# Altium schematic sheet analog_current_output.schdoc
size A3; Organization: Altium Limited; Address1: L3, 12a Rodborough Rd; Address2: Frenchs Forest; Address3: NSW; Address4: Australia 2086
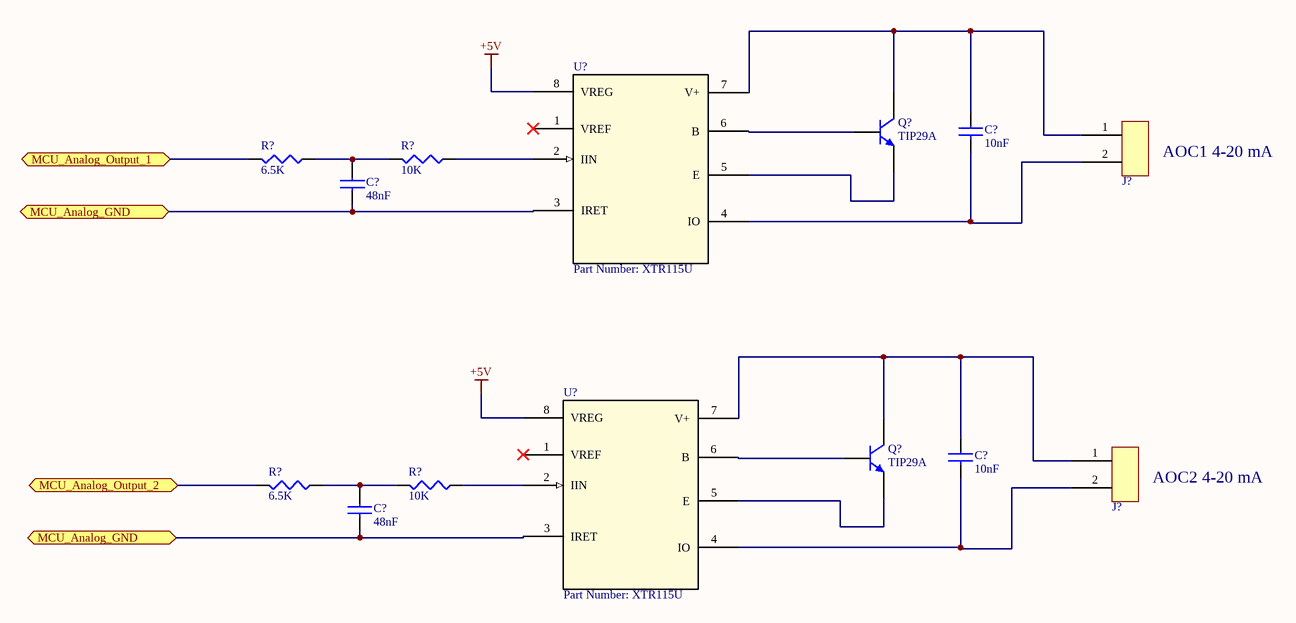
[diagram p0: analog_current_output.schdoc]

## Parts
(Parts that share a designator on the sheet are numbered #1, #2 ... from top to bottom, then left to right.)
C?#1  value 10nF  [0402 SMD Ceramic Capacitor]  (hidden comment: 0402_10nF)
C?#2  value 48nF  [0805 SMD Ceramic Capacitor]  (hidden comment: C0805C333)
C?#3  value 10nF  [0402 SMD Ceramic Capacitor]  (hidden comment: 0402_10nF)
C?#4  value 48nF  [0805 SMD Ceramic Capacitor]  (hidden comment: C0805C333)
J?#1  2x Terminal  [2x Terminal mini]  (value not drawn)
J?#2  2x Terminal  [2x Terminal mini]  (value not drawn)
Q?#1  TIP29A  [TO220 SMD]
Q?#2  TIP29A  [TO220 SMD]
R?#1  value 6.5K  [0805 Resistor]  (hidden comment: 0805_1K)
R?#2  value 10K  [0805 Resistor]  (hidden comment: 0805_1K)
R?#3  value 6.5K  [0805 Resistor]  (hidden comment: 0805_1K)
R?#4  value 10K  [0805 Resistor]  (hidden comment: 0805_1K)
U?#1  Part Number: XTR115U  [D8]
U?#2  Part Number: XTR115U  [D8]

## Ports
MCU_Analog_GND (bidir), MCU_Analog_Output_1 (bidir), MCU_Analog_Output_2 (bidir)

## Nets
+5V: U?#1.8(VREG) U?#2.8(VREG)
MCU_Analog_GND: C?#2.2 C?#4.2 U?#1.3(IRET) U?#2.3(IRET) ; port MCU_Analog_GND
MCU_Analog_Output_1: R?#1.2 ; port MCU_Analog_Output_1
MCU_Analog_Output_2: R?#3.2 ; port MCU_Analog_Output_2
NetC?#1_1: C?#1.1 J?#1.1 Q?#1.2(C) U?#1.7(V+)
NetC?#1_2: C?#1.2 J?#1.2 U?#1.4(IO)
NetC?#2_1: C?#2.1 R?#1.1 R?#2.2
NetC?#3_1: C?#3.1 J?#2.1 Q?#2.2(C) U?#2.7(V+)
NetC?#3_2: C?#3.2 J?#2.2 U?#2.4(IO)
NetC?#4_1: C?#4.1 R?#3.1 R?#4.2
NetQ?#1_1: Q?#1.1(B) U?#1.6(B)
NetQ?#1_3: Q?#1.3(E) U?#1.5(E)
NetQ?#2_1: Q?#2.1(B) U?#2.6(B)
NetQ?#2_3: Q?#2.3(E) U?#2.5(E)
NetR?#2_1: R?#2.1 U?#1.2(IIN)
NetR?#4_1: R?#4.1 U?#2.2(IIN)

Not connected (* = marked no-connect by the designer): U?#1 1(VREF)*; U?#2 1(VREF)*

## Notes on the sheet
- (near J?#1) AOC1 4-20 mA
- (near J?#2) AOC2 4-20 mA
- Title
- Size:
- Date:
- A3
- Number:
- Time:
- Revision:
- Sheet
- of
- File:

## Library data of the parts
C?#1 C?#3 = 0402_10nF: Manufacturer: MURATA; Manufacturer Code: GRM155R71C103KA01D; Tolerance: ±10%; Voltage: 25V; Dielectric Characteristic: X7R; Unit Price: 0,014 €; Farnell Code: 8819734; MOQ: 10; Package: 0402
C?#2 C?#4 = C0805C333: Manufacturer Code: MC0805B333K500CT; Manufacturer: MULTICOMP; Voltage: 50V; Tolerace: ± 10%; Farnell Code: 1759257; Unit Price: 0,022 €; MOQ: 10; Package: 0805
J?#1 J?#2 = 2x Terminal: Manufacturer: WEIDMULLER; Manufacturer Code: PM5.08/2/90 BLK; Value: 2x Terminal; Farnell Code: 1131855; Unit Price: 0,55 €
Q?#1 Q?#2 = TIP29A: Manufacturer: STM Electronics; Voltage: 60V; Manufacturer Code: TIP29A; Unit Price: 0,19 €; Q?: TIP29A
R?#1-R?#4 = 0805_1K: Manufacturer Code: MC01W080511K; Manufacturer: MULTICOMP; Tolerance: ±1%; Farnell Code: 9332383; Unit Price: 0,03 €
U?#1 U?#2 = XTR115U: 4-20mA Current Loop Transmitters; Manufacturer: Texas Instruments; GENERIC_PART_NUMBER: XTR115; INDUSTRY_STD_PKG_TYPE: SOIC; FAMILY_NAME: 4-20MA CONDITIONING; PIN_COUNT: 8; PACKAGE_DESIGNATOR: D; Datasheet_URL: http://www.ti.com/lit/gpn/XTR115; Vendor: Texas Instruments; Manufacturer_Part_Number: XTR115U; Copyright: Copyright (C) 2018 Accelerated Designs. All rights reserved; RefDes: RefDes; Type: DEV; Value: Value